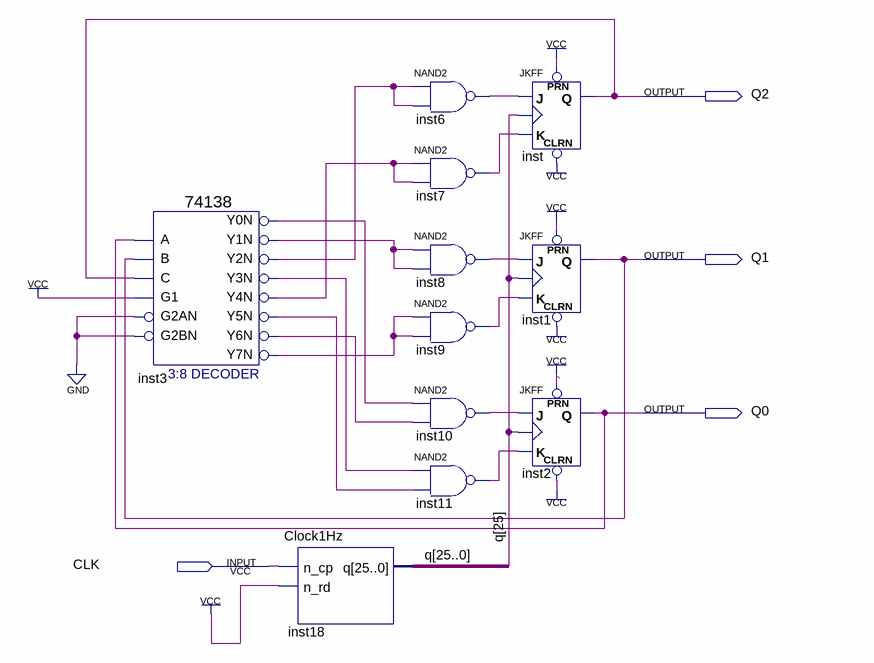
[diagram p0: schematic sheet]
// Quartus schematic GrayCounter.bdf as structural Verilog: 11 symbols, 4 pins
module GrayCounter (
  input  CLK,
  output Q2,
  output Q1,
  output Q0
);

  wire inst3_y0n, inst3_y1n, inst3_y2n, inst3_y3n, inst3_y4n, inst3_y5n, inst3_y6n, inst3_y7n, inst6_out,
       inst7_out, inst8_out, inst9_out, inst10_out, inst11_out;
  wire [25:3] q;

  \74138  inst3 (
    .A(Q0), .B(Q1), .G1(1'b1), .C(Q2), .G2AN(1'b0), .G2BN(1'b0), .Y0N(inst3_y0n), .Y1N(inst3_y1n),
    .Y2N(inst3_y2n), .Y3N(inst3_y3n), .Y4N(inst3_y4n), .Y5N(inst3_y5n), .Y6N(inst3_y6n), .Y7N(inst3_y7n));
  Clock1Hz inst18 (.n_cp(CLK), .n_rd(1'b1), .q({q, Q2, Q1, Q0}));
  nand inst6 (inst6_out, inst3_y2n, inst3_y2n);
  nand inst7 (inst7_out, inst3_y4n, inst3_y4n);
  nand inst8 (inst8_out, inst3_y1n, inst3_y1n);
  nand inst9 (inst9_out, inst3_y7n, inst3_y7n);
  nand inst10 (inst10_out, inst3_y0n, inst3_y6n);
  nand inst11 (inst11_out, inst3_y3n, inst3_y5n);
  JKFF inst (.PRN(1'b1), .CLRN(1'b1), .K(inst7_out), .J(inst6_out), .CLK(q[25]), .Q(Q2));
  JKFF inst1 (.PRN(1'b1), .CLRN(1'b1), .K(inst9_out), .J(inst8_out), .CLK(q[25]), .Q(Q1));
  JKFF inst2 (.PRN(1'b1), .CLRN(1'b1), .K(inst11_out), .J(inst10_out), .CLK(q[25]), .Q(Q0));

  // Notes on the sheet:
  //   `
endmodule
